# EAGLE design beVimPowerBoard (EAGLE 7.3.0)
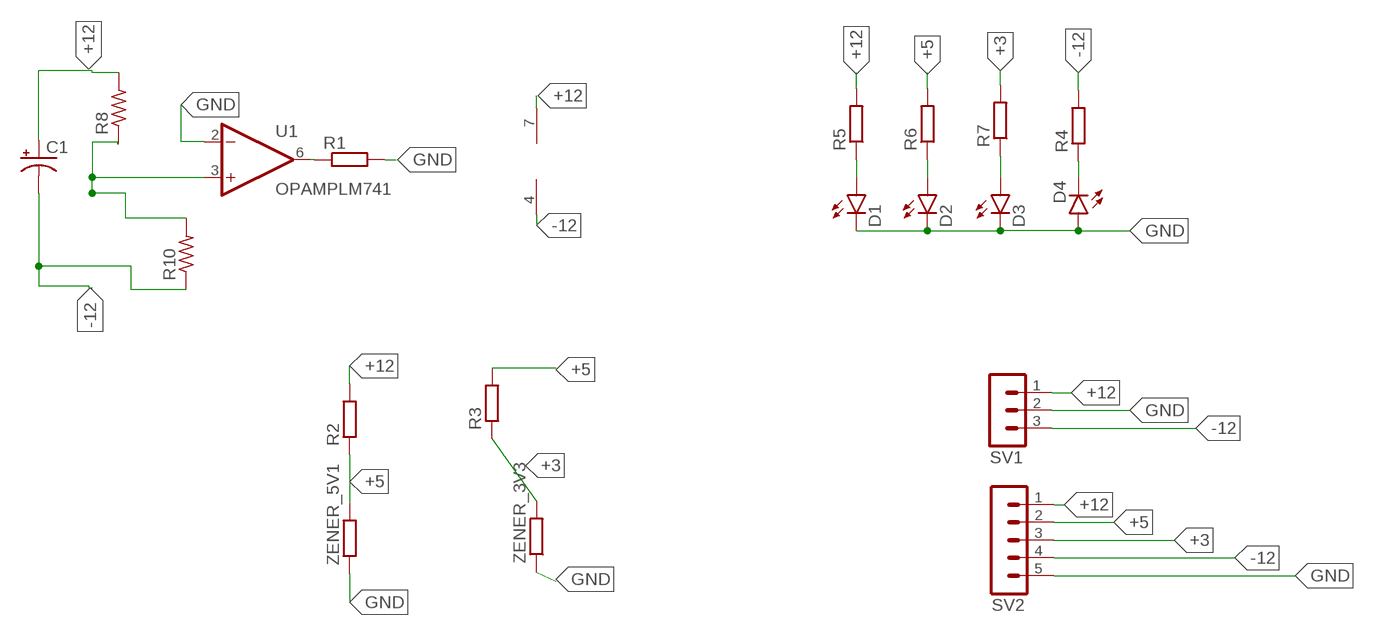
[diagram p0: schematic, sheet 1]

## Parts
C1  CAPACITOR-POLARIZEDRADIAL-POLARIZED-6.3MM-TANTALUM  [RADIAL-POLARIZED-6.3MM-TANTALUM]
D1  LED5MM  [LED5MM]
D2  LED5MM  [LED5MM]
D3  LED5MM  [LED5MM]
D4  LED5MM  [LED5MM]
R1  R-EU_0817/7V  [P0817V]
R2  R-EU_0817/7V  [P0817V]
R3  R-EU_0817/7V  [P0817V]
R4  R-EU_0817/7V  [P0817V]
R5  R-EU_0817/7V  [P0817V]
R6  R-EU_0817/7V  [P0817V]
R7  R-EU_0817/7V  [P0817V]
R8  R-US_0309/12  [0309/12]
R10  R-US_0309/12  [0309/12]
SV1  MA03-1  [MA03-1]
SV2  MA05-1  [MA05-1]
U1  OPAMPLM741  [DIP8]
ZENER_3V3  R-EU_0817/7V  [P0817V]
ZENER_5V1  R-EU_0817/7V  [P0817V]

## Nets
+3: R3.1 R7.2 SV2.3 ZENER_3V3.2
+5: R2.1 R3.2 R6.2 SV2.2 ZENER_5V1.2
+12: C1.+ R2.2 R5.2 R8.2 SV1.1 SV2.1 U1.7(VCC)
-12: C1.- R4.2 R10.1 SV1.3 SV2.4 U1.4(VEE)
GND: D1.K(C) D2.K(C) D3.K(C) D4.A R1.2 SV1.2 SV2.5 U1.2(IN-) ZENER_3V3.1 ZENER_5V1.1
N$1: D1.A R5.1
N$2: D2.A R6.1
N$3: D3.A R7.1
N$4: D4.K(C) R4.1
N$5: R1.1 U1.6(OUT)
N$7: R8.1 R10.2 U1.3(IN+)

## Library data of the parts
C1 = Capacitors:CAPACITOR-POLARIZED: Capacitor, polarized; SPICE: C{NAME} {+.NET} {-.NET} {VALUE}
D1-D4 = SparkFun-LED:LED: LEDs Standard schematic elements and footprints for 5mm, 3mm, 1206, and 0603 sized LEDs. 5mm - Spark Fun Electronics SKU : COM-00529 (and others)
R1-R7 ZENER_3V3 ZENER_5V1 = resistor:R-EU_: RESISTOR, European symbol
R8 R10 = rcl:R-US_: RESISTOR, American symbol
SV1 = con-lstb:MA03-1: PIN HEADER; OC_FARNELL: unknown; OC_NEWARK: unknown
SV2 = con-lstb:MA05-1: PIN HEADER; OC_FARNELL: unknown; OC_NEWARK: unknown
U1 = Op Amps:OPAMP: Operational amplifier; SPICE: X{NAME} {IN+.NET} {IN-.NET} {VCC.NET} {VEE.NET} {OUT.NET} LM741; SPICEMOD: .SUBCKT LM741 1 2 99 50 28\nIOS 2 1 20N\nR1 1 3 250K\nR2 3 2 250K\nI1 4 50 100U\nR3 5 99 517\nR4 6 99 517\nQ1 5 2 4 QX\nQ2 6 7 4 QX\nC4 5 6 60.3614P\nI2 99 50 1.6MA\nEOS 7 1 POLY(1) 16 49 1E-3 1\nR8 99 49 40K\nR9 49 50 40K\nV2 99 8 1.63\nD1 9 8 DX\nD2 10 9 DX\nV3 10 50 1.63\nEH 99 98 99 49 1\nG1 98 9 5 6 2.1E-3\nR5 98 9 95.493MEG\nC3 98 9 333.33P\nG3 98 15 9 49 1E-6\nR12 98 15 1MEG\nC5 98 15 5.3052E-15\nG4 98 16 3 49 3.1623E-8\nL2 98 17 530.5M\nR13 17 16 1K\nF6 50 99 POLY(1) V6 450U 1\nE1 99 23 99 15 1\nR16 24 23 25\nD5 26 24 DX\nV6 26 22 0.65V\nR17 23 25 25\nD6 25 27 DX\nV7 22 27 0.65V\nV5 22 21 0.18V\nD4 21 15 DX\nV4 20 22 0.18V\nD3 15 20 DX\nL3 22 28 100P\nRL3 22 28 100K\n.MODEL DX D(IS=1E-15)\n.MODEL QX NPN(BF=625)\n.ENDS

## Board
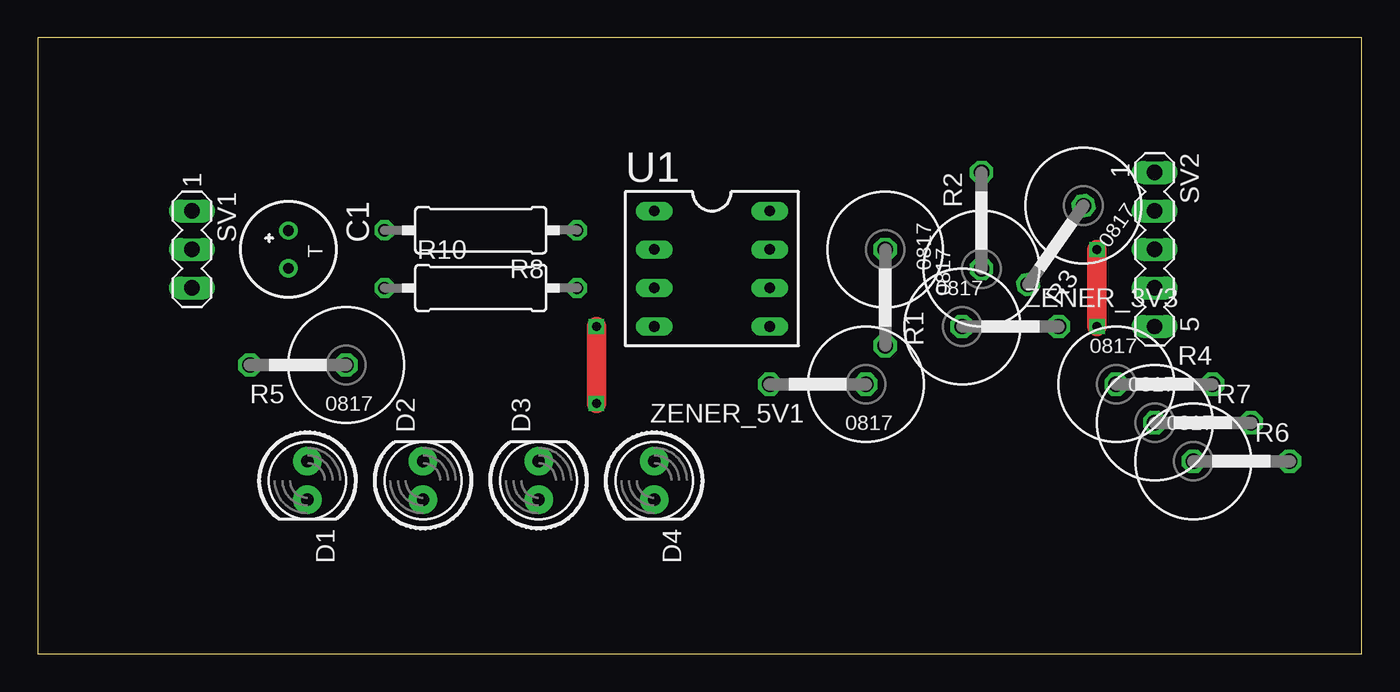
[diagram p1: board, top side]
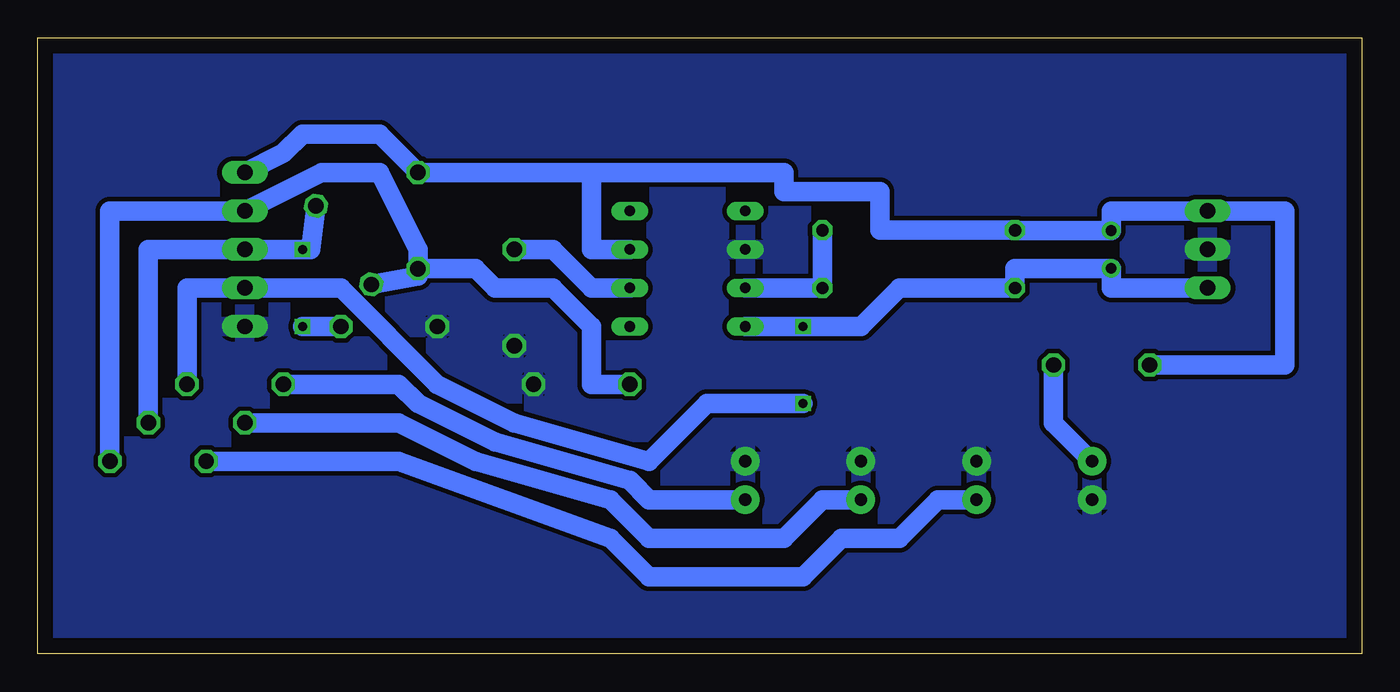
[diagram p2: board, bottom side, seen from below]

Size 87.3 x 40.63 mm. Coordinates in mm from the lower left corner, seen from the top.
Outline: 0,0 87.3,0 87.3,40.63 0,40.63 0,0
Copper layers (1*16): Top 0.035mm / dielectric 1.5mm / Bottom 0.035mm
Design rules "default *": minimum track width 10mil, minimum drill 24mil, track to track 12mil, track to pad 12mil, pad to pad 12mil, via to via 12mil, smd to smd 8mil, copper to edge 40mil, drill to drill 8mil, minimum pad ring 10mil, minimum via ring 8mil, stop-mask expansion 4mil, vias tented up to drill 0mil, thermal gap 10mil

### Footprints (pad centres in the part's own frame; a part is rotated, then mirrored left to right if it is on the bottom)
RADIAL-POLARIZED-6.3MM-TANTALUM = drill 0.7: + -1.25,0; - 1.25,0
LED5MM = drill 0.813 pad 1.88: A -1.27,0; K 1.27,0
P0817V = drill 1.016 octagon: 1 -5.08,0; 2 1.27,0
0309/12 = drill 0.813 octagon: 1 -6.35,0; 2 6.35,0
MA03-1 = drill 1.016 long: 1 -2.54,0; 2 0,0; 3 2.54,0
MA05-1 = drill 1.016 long: 1 -5.08,0; 2 -2.54,0; 3 0,0; 4 2.54,0; 5 5.08,0
DIP8 = drill 0.7 long: 1 0,2.54; 2 0,0; 3 0,-2.54; 4 0,-5.08; 5 7.62,-5.08; 6 7.62,-2.54; 7 7.62,0; 8 7.62,2.54

### Placement (x,y rotation side)
C1  16.51,26.67 270 top
D1  17.78,11.43 270 top
D2  25.4,11.43 90 top
D3  33.02,11.43 90 top
D4  40.64,11.43 270 top
R1  55.88,21.59 270 top
R2  62.23,30.48 90 top
R3  66.04,25.4 235 top
R4  76.2,17.78 0 top
R5  15.24,19.05 180 top
R6  81.28,12.7 0 top
R7  78.74,15.24 0 top
R8  29.21,27.94 180 top
R10  29.21,24.13 0 top
SV1  10.16,26.67 270 top
SV2  73.66,26.67 270 top
U1  40.64,26.67 0 top
ZENER_3V3  66.04,21.59 0 top
ZENER_5V1  49.53,17.78 180 top

### Tracks (layer width: path | path; a pad name or v marks a point on that pad's centre or on a via)
+3  (via drill 0.6)
  Top 1.27: v69.85,21.59 v69.85,26.67
  Bottom 1.27: R3.1 69.31,26.67 v69.85,26.67 SV2.3 80.01,26.67 R7.2 | ZENER_3V3.2 v69.85,21.59
+5
  Bottom 1.27: R2.1 58.42,25.4 57.15,24.13 53.34,24.13 50.8,21.59 50.8,17.78 ZENER_5V1.2 | R2.1 62.23,24.9 R3.2 | R2.1 62.23,26.67 64.77,31.75 68.58,31.75 SV2.2 82.55,29.21 R6.2
+12
  Bottom 1.27: U1.7 50.8,26.67 50.8,31.75 | 50.8,31.75 38.1,31.75 38.1,30.48 31.75,30.48 31.75,27.94 R8.2 22.86,27.92 C1.+ 16.51,29.21 SV1.1 5.08,29.21 5.08,19.05 R5.2 | 50.8,31.75 R2.2 64.77,34.29 69.85,34.29 71.12,33.02 SV2.1
-12  (via drill 0.6)
  Top 1.27: v36.83,16.51 v36.83,21.59
  Bottom 1.27: 16.51,25.4 22.86,25.4 R10.1 30.48,24.13 33.02,21.59 v36.83,21.59 U1.4 | 16.51,25.4 C1.- | 16.51,25.4 16.51,24.13 SV1.3 | R4.2 77.47,24.13 SV2.4 67.31,24.13 60.96,17.78 55.88,15.24 46.99,12.7 43.18,16.51 v36.83,16.51
GND
  pour Bottom: 0,40.64 0,0 87.63,0 87.63,40.64
N$1
  Bottom 1.27: D1.A 20.32,15.24 R5.1
N$2
  Bottom 1.27: R6.1 63.5,12.7 49.53,7.62 46.99,5.08 36.83,5.08 34.29,7.62 30.48,7.62 27.94,10.16 D2.A
N$3
  Bottom 1.27: D3.A 35.56,10.16 38.1,7.62 46.99,7.62 49.53,10.16 58.42,12.7 63.5,15.24 R7.1
N$4
  Bottom 1.27: D4.K 46.99,10.16 48.26,11.43 57.15,13.97 62.23,16.51 63.5,17.78 R4.1
N$5
  Bottom 1.27: R1.1 53.34,26.67 50.8,24.13 U1.6
N$7
  Bottom 1.27: R8.1 R10.2 U1.3